# Altium schematic sheet 2_Microcontroler.SchDoc
size A4; SheetNumber: 2; SheetTotal: 4
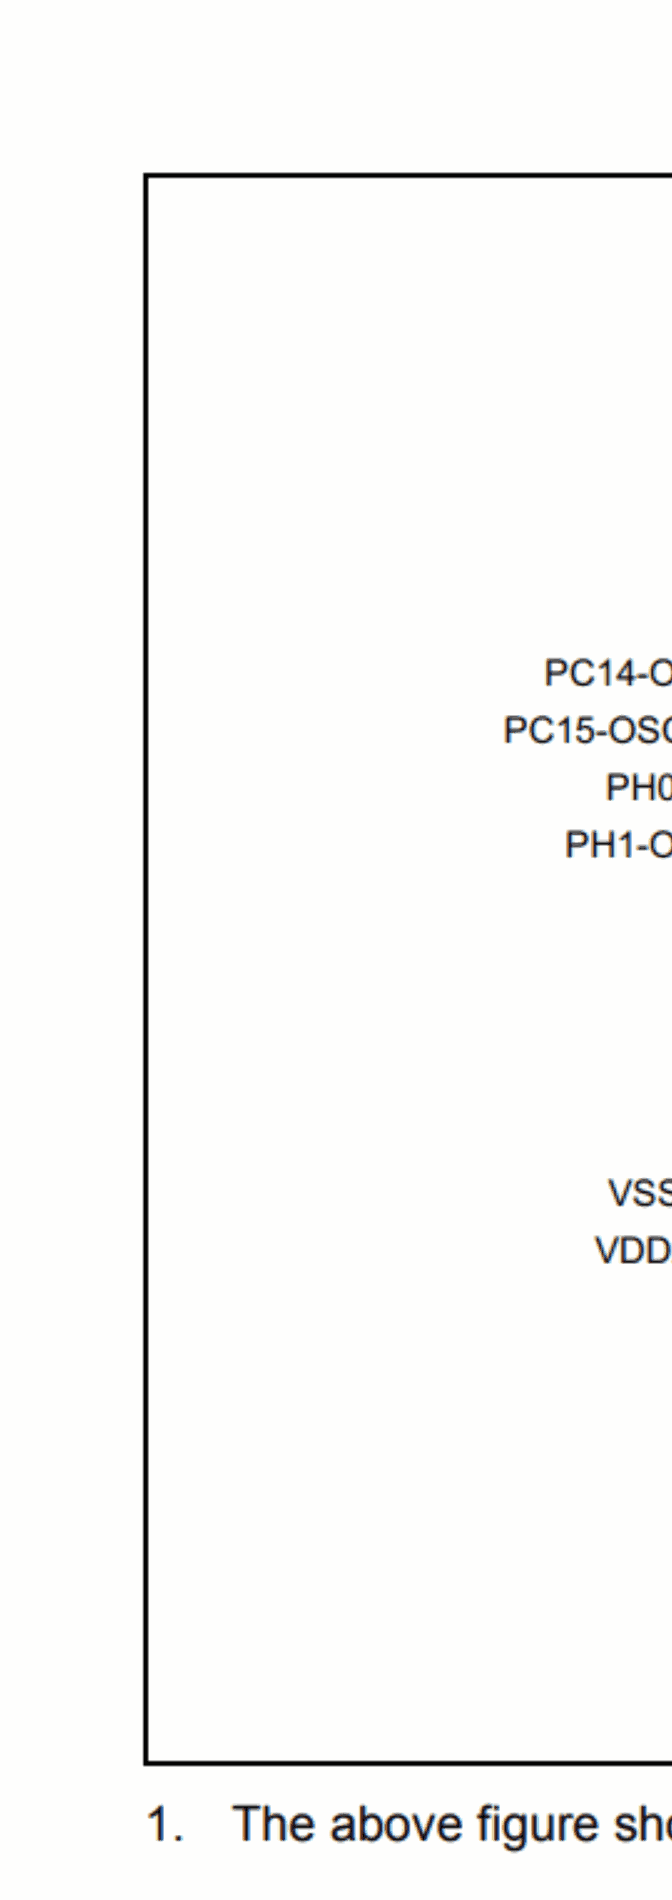
[diagram p0: 2_Microcontroler.SchDoc, top left]
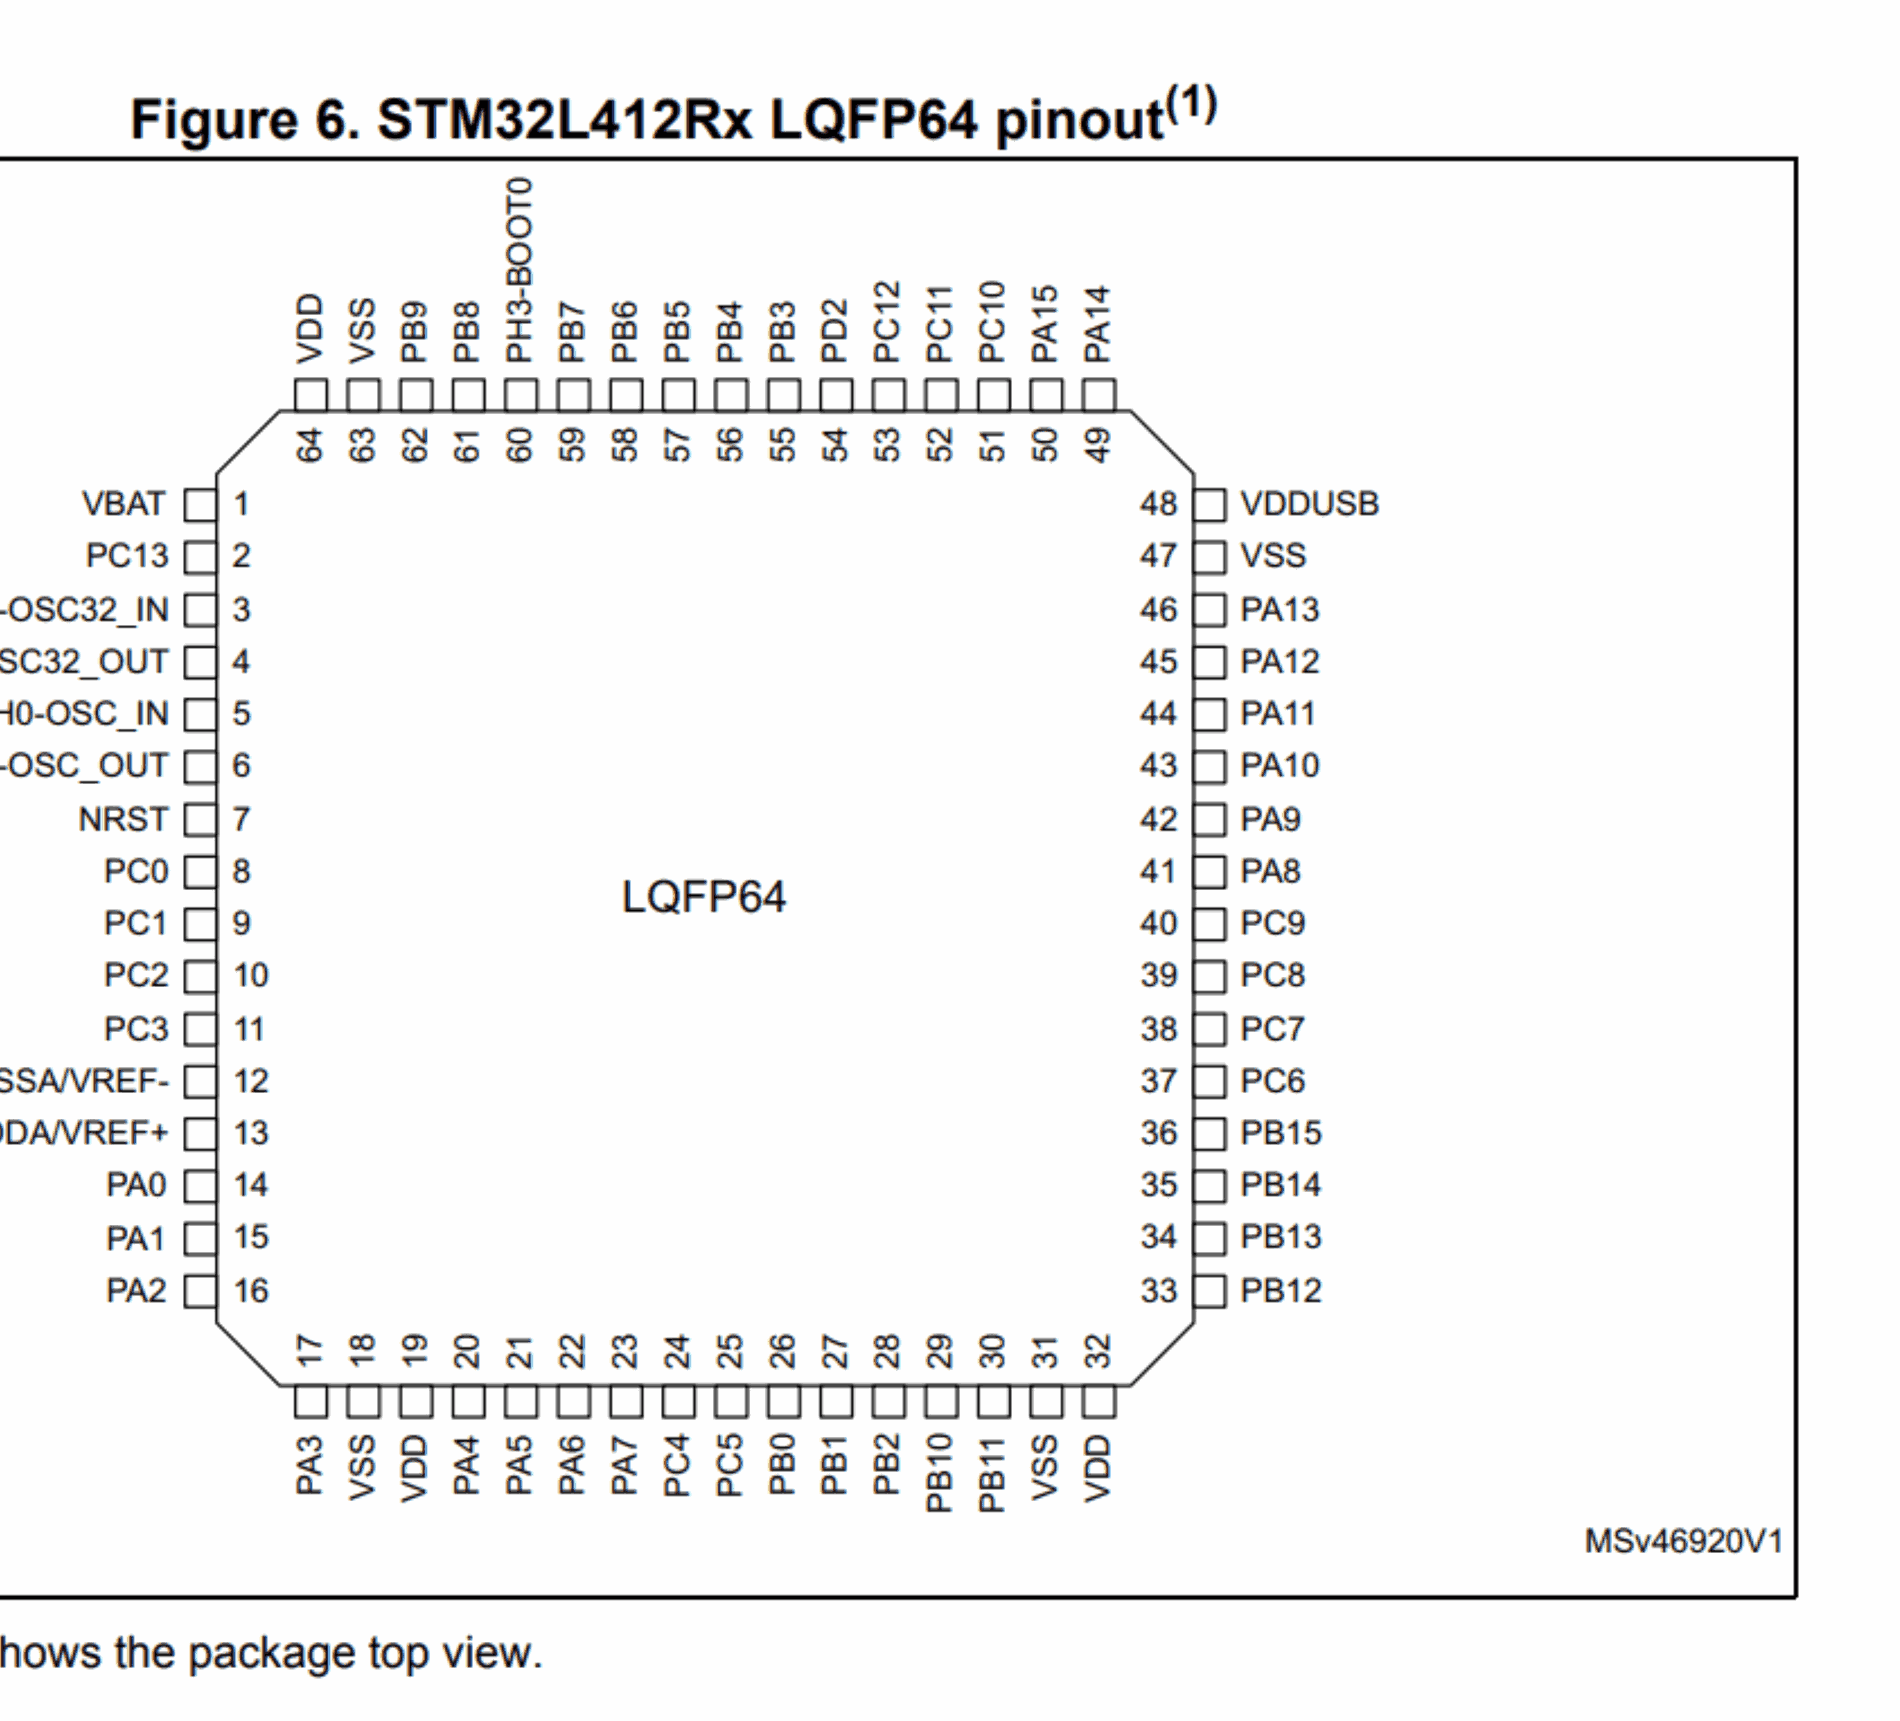
[diagram p1: 2_Microcontroler.SchDoc, top middle]
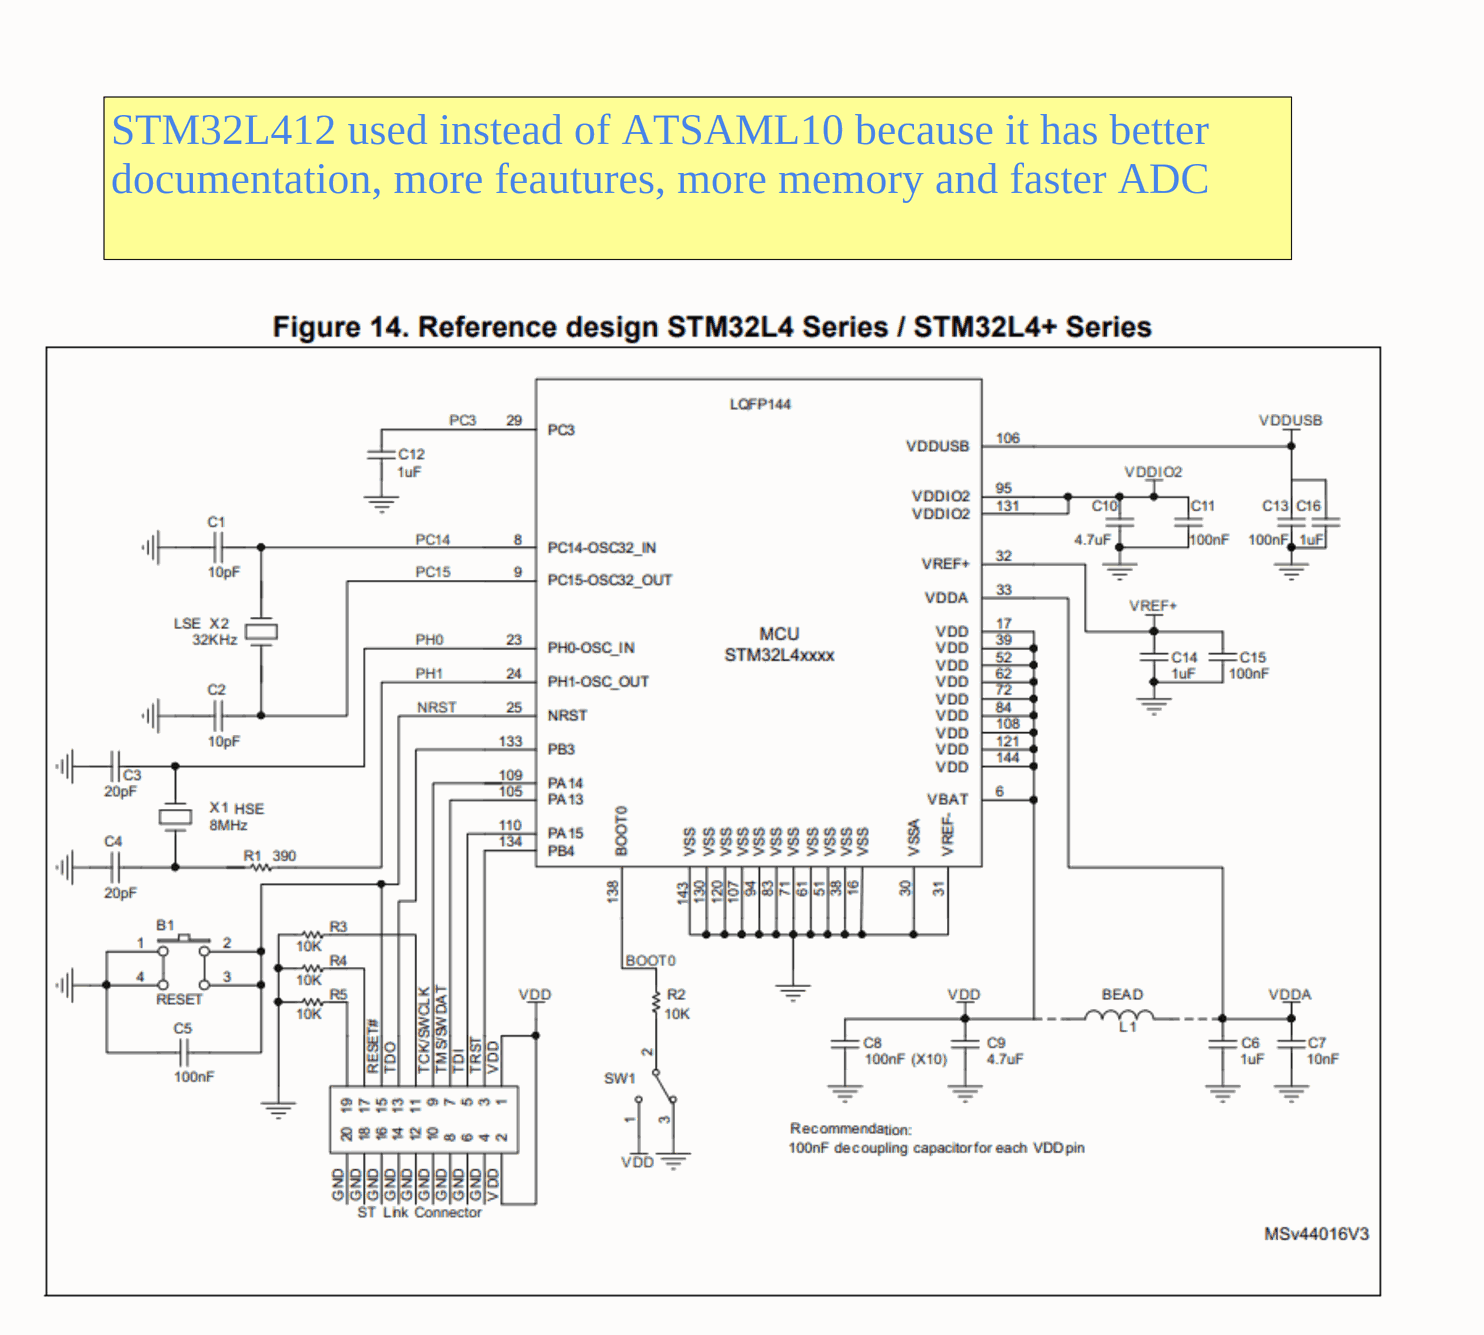
[diagram p2: 2_Microcontroler.SchDoc, bottom left]
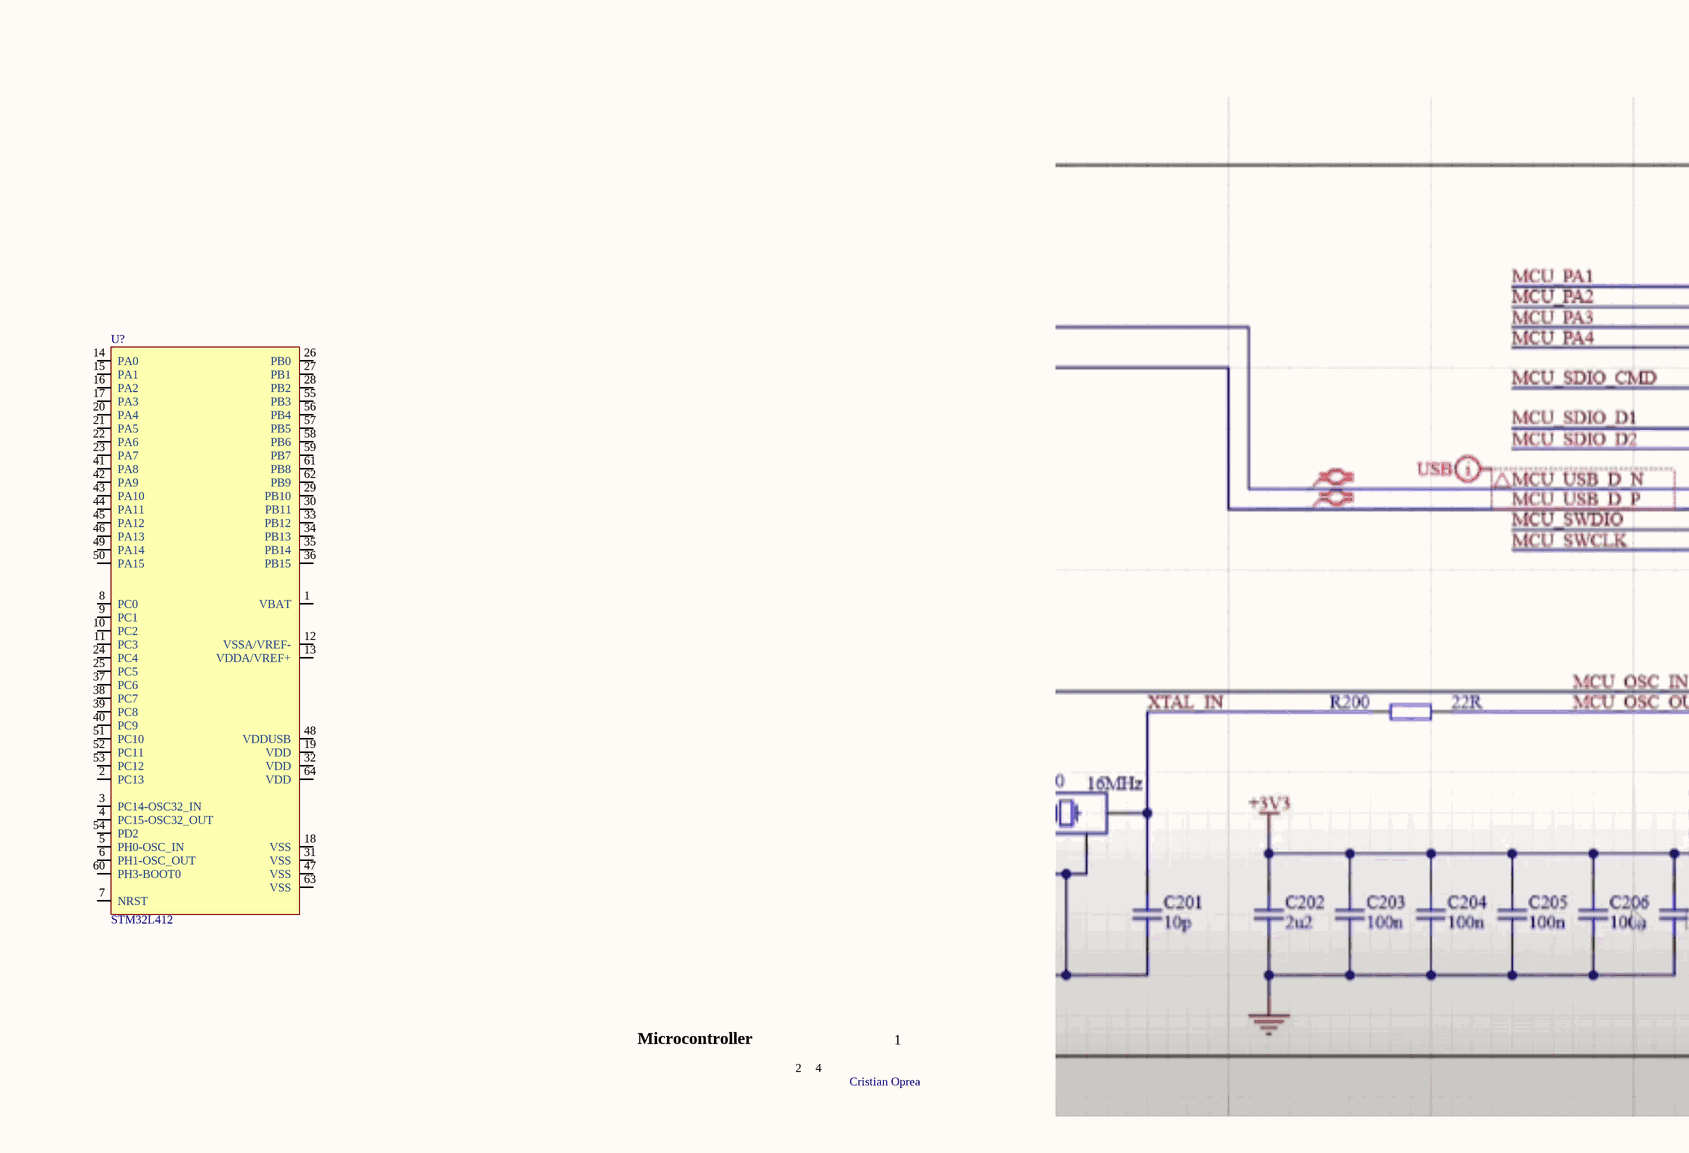
[diagram p3: 2_Microcontroler.SchDoc, bottom middle]
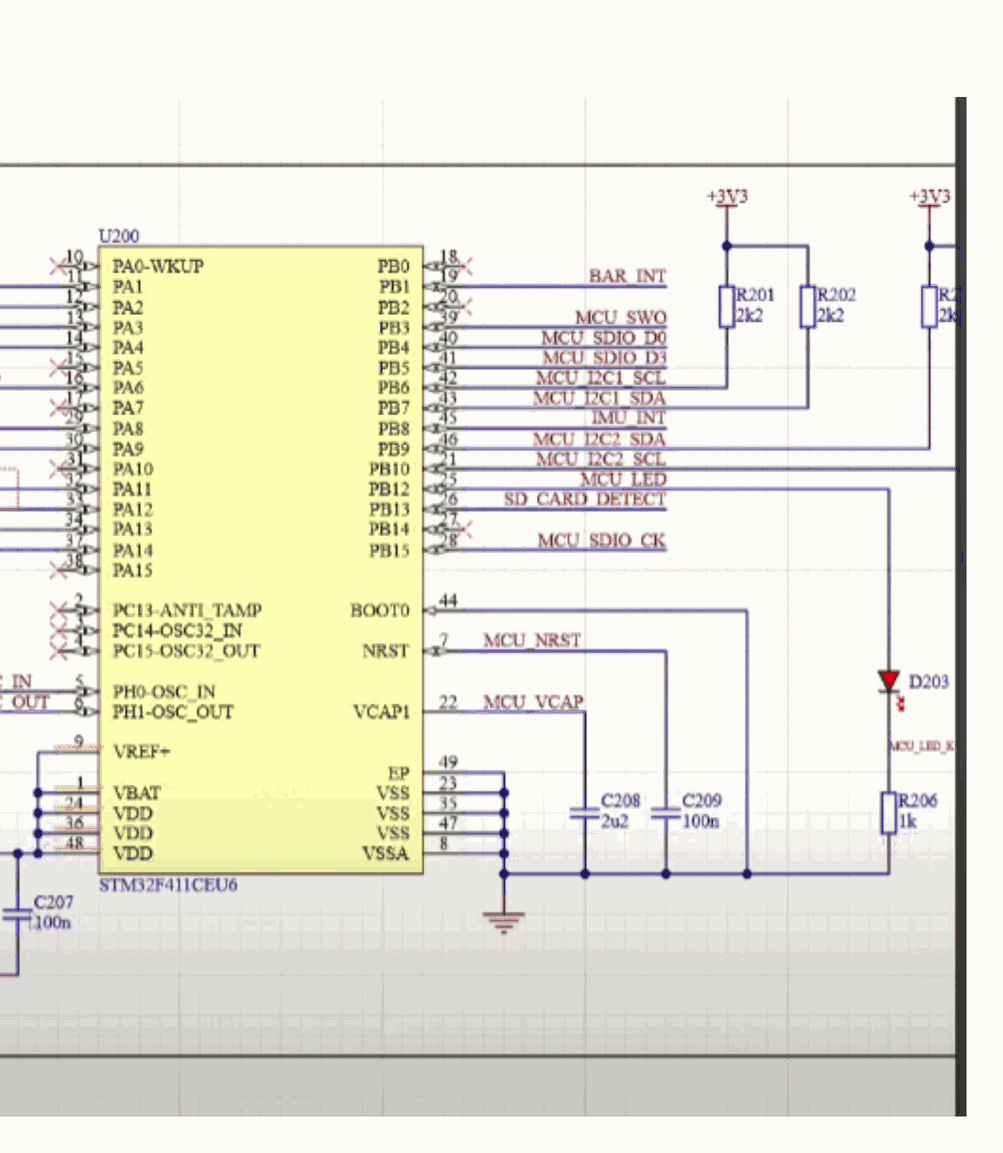
[diagram p4: 2_Microcontroler.SchDoc, bottom right]

## Parts
U?  STM32L412

## Nets

Not connected (* = marked no-connect by the designer): U? 1(VBAT) 2(PC13) 3(PC14-OSC32_IN) 4(PC15-OSC32_OUT) 5(PH0-OSC_IN) 6(PH1-OSC_OUT) 7(NRST) 8(PC0) 9(PC1) 10(PC2) 11(PC3) 12(VSSA/VREF-) 13(VDDA/VREF+) 14(PA0) 15(PA1) 16(PA2) 17(PA3) 18(VSS) 19(VDD) 20(PA4) 21(PA5) 22(PA6) 23(PA7) 24(PC4) 25(PC5) 26(PB0) 27(PB1) 28(PB2) 29(PB10) 30(PB11) 31(VSS) 32(VDD) 33(PB12) 34(PB13) 35(PB14) 36(PB15) 37(PC6) 38(PC7) 39(PC8) 40(PC9) 41(PA8) 42(PA9) 43(PA10) 44(PA11) 45(PA12) 46(PA13) 47(VSS) 48(VDDUSB) 49(PA14) 50(PA15) 51(PC10) 52(PC11) 53(PC12) 54(PD2) 55(PB3) 56(PB4) 57(PB5) 58(PB6) 59(PB7) 60(PH3-BOOT0) 61(PB8) 62(PB9) 63(VSS) 64(VDD)

## Notes on the sheet
- STM32L412 used instead of ATSAML10 because it has better documentation, more feautures, more memory and faster ADC
- Microcontroller
- 2
- 4
- 1
- Cristian Oprea

## Library data of the parts
U? = STM32L412: Ultra-low-power Arm® Cortex®-M4 32-bit MCU+FPU, 100DMIPS, / up to 128KB flash, 40KB SRAM(LQFP64)